# Altium schematic sheet switching_noise_board.SchDoc: Switching Noise Board
size A4; DrawnBy: Rajat Chaple; Revision: 0.0.1; SheetNumber: 1; SheetTotal: 1
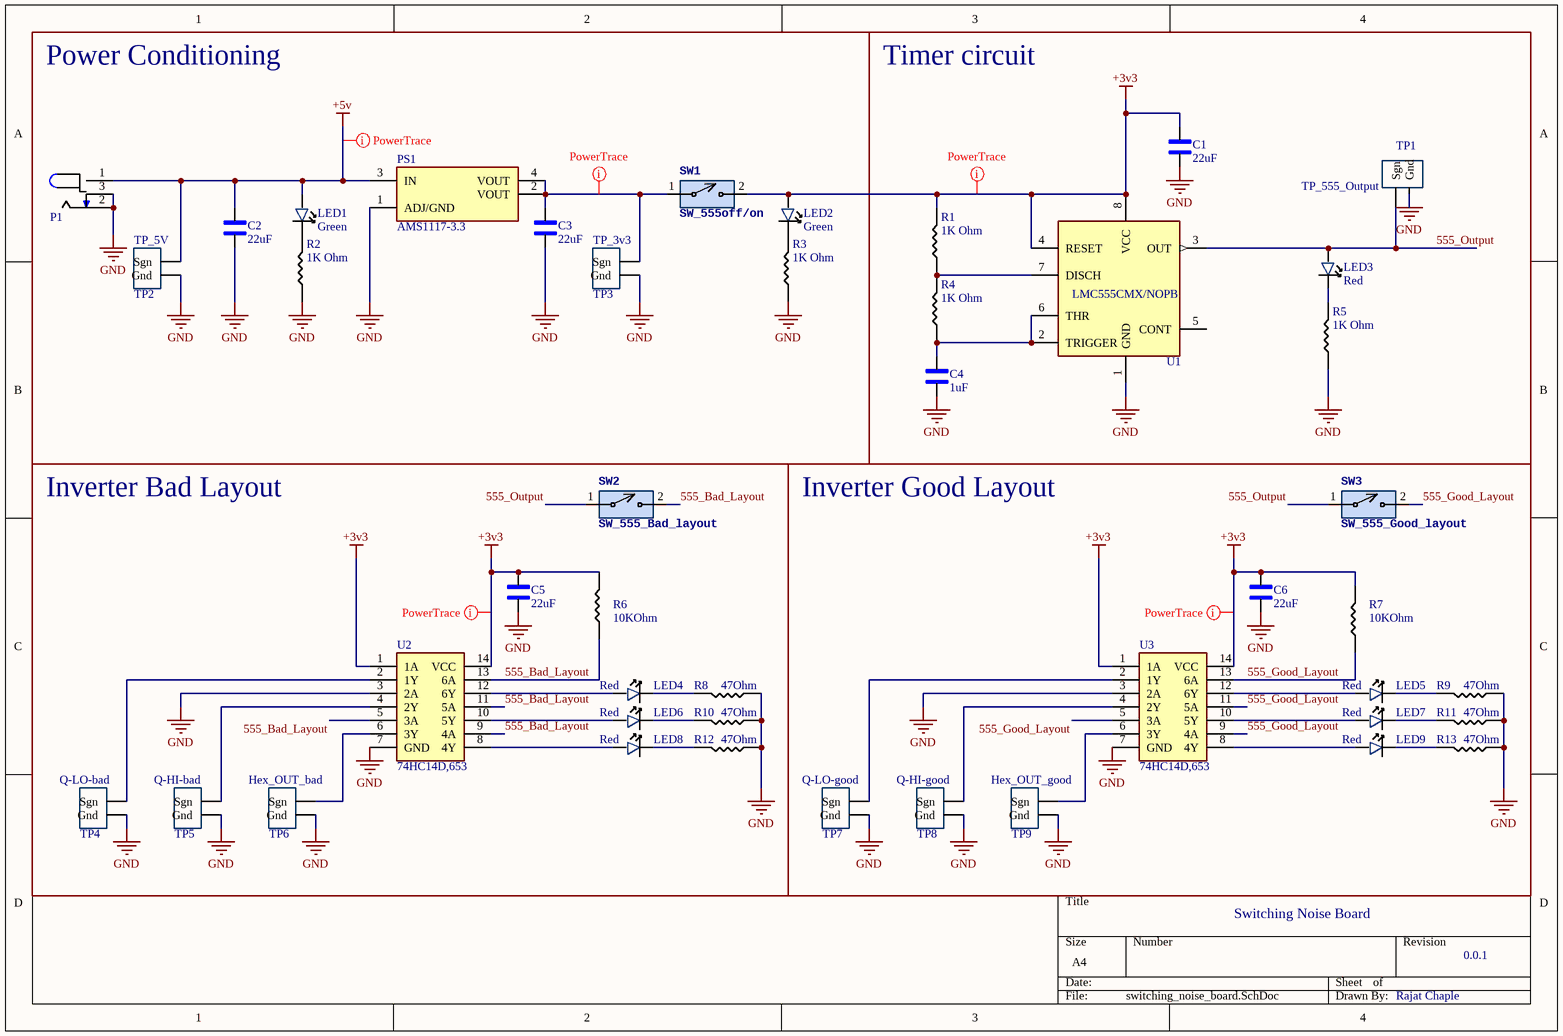
[diagram p0: switching_noise_board.SchDoc]

## Parts
C1  22uF  [0805_Passive_Capaciitor]
C2  22uF  [0805_Passive_Capaciitor]
C3  22uF  [0805_Passive_Capaciitor]
C4  1uF  [0402_Passive_Capacitor]
C5  22uF  [0805_Passive_Capaciitor]
C6  22uF  [0805_Passive_Capaciitor]
LED1  value Green  [LED_0603]  (hidden comment: KT-0603R)
LED2  value Green  [LED_0603]  (hidden comment: KT-0603R)
LED3  value Red  [LED_0603]  (hidden comment: KT-0603R)
LED4  value Red  [LED_0603]  (hidden comment: KT-0603R)
LED5  value Red  [LED_0603]  (hidden comment: KT-0603R)
LED6  value Red  [LED_0603]  (hidden comment: KT-0603R)
LED7  value Red  [LED_0603]  (hidden comment: KT-0603R)
LED8  value Red  [LED_0603]  (hidden comment: KT-0603R)
LED9  value Red  [LED_0603]  (hidden comment: KT-0603R)
P1  Power Jack  [Power_Jack]  (value not drawn)
PS1  AMS1117-3.3  [LDO]
R1  value 1K Ohm  [0805_Passive_Resistor]  (hidden comment: 1k)
R2  value 1K Ohm  [0805_Passive_Resistor]  (hidden comment: 1k)
R3  value 1K Ohm  [0805_Passive_Resistor]  (hidden comment: 1k)
R4  value 1K Ohm  [0805_Passive_Resistor]  (hidden comment: 1k)
R5  value 1K Ohm  [0805_Passive_Resistor]  (hidden comment: 1k)
R6  value 10KOhm  [0402_Passive_Resistor]  (hidden comment: 10k)
R7  value 10KOhm  [0402_Passive_Resistor]  (hidden comment: 10k)
R8  value 47Ohm  [0402_Passive_Resistor]  (hidden comment: 47 Ohms)
R9  value 47Ohm  [0402_Passive_Resistor]  (hidden comment: 47 Ohms)
R10  value 47Ohm  [0402_Passive_Resistor]  (hidden comment: 47 Ohms)
R11  value 47Ohm  [0402_Passive_Resistor]  (hidden comment: 47 Ohms)
R12  value 47Ohm  [0402_Passive_Resistor]  (hidden comment: 47 Ohms)
R13  value 47Ohm  [0402_Passive_Resistor]  (hidden comment: 47 Ohms)
SW1  SW_555off/on  [2Pin-Header-Conn]
SW2  SW_555_Bad_layout  [2Pin-Header-Conn]
SW3  SW_555_Good_layout  [2Pin-Header-Conn]
TP1  TP_555_Output  [TP10x_Probe]
TP2  TP_5V  [TP10x_Probe]
TP3  TP_3v3  [TP10x_Probe]
TP4  Q-LO-bad  [TP10x_Probe]
TP5  Q-HI-bad  [TP10x_Probe]
TP6  Hex_OUT_bad  [TP10x_Probe]
TP7  Q-LO-good  [TP10x_Probe]
TP8  Q-HI-good  [TP10x_Probe]
TP9  Hex_OUT_good  [TP10x_Probe]
U1  LMC555CMX/NOPB  [TS555IDTTR]
U2  74HC14D,653  [HEX_74AC14]
U3  74HC14D,653  [HEX_74AC14]

## Blocks framed on the sheet
Power Conditioning: C2 C3 LED1 LED2 P1 PS1 R2 R3 SW1 TP2 TP3
Timer circuit: C1 C4 LED3 R1 R4 R5 TP1 U1
Inverter Bad Layout: C5 LED4 LED6 LED8 R6 R8 R10 R12 SW2 TP4-TP6 U2
Inverter Good Layout: C6 LED5 LED7 LED9 R7 R9 R11 R13 SW3 TP7-TP9 U3

## Nets
+3v3: C1.2 C5.2 C6.2 LED2.1 R1.2 R6.2 R7.2 SW1.2 U1.4(RESET) U1.8(VCC) U2.1(1A) U2.14(VCC) U3.1(1A) U3.14(VCC)
+5v: C2.2 LED1.1 P1.1 PS1.3(IN) TP2.1(Sgn)
GND: C1.1 C2.1 C3.1 C4.1 C5.1 C6.1 P1.2 P1.3 PS1.1(ADJ/GND) R2.1 R3.1 R5.1 R8.1 R9.1 R10.1 R11.1 R12.1 R13.1 TP1.2(Gnd) TP2.2(Gnd) TP3.2(Gnd) TP4.2(Gnd) TP5.2(Gnd) TP6.2(Gnd) TP7.2(Gnd) TP8.2(Gnd) TP9.2(Gnd) U1.1(GND) U2.3(2A) U2.7(GND) U3.3(2A) U3.7(GND)
555_Bad_Layout: R6.1 SW2.2 U2.5(3A) U2.9(4A) U2.11(5A) U2.13(6A)
555_Good_Layout: R7.1 SW3.2 U3.5(3A) U3.9(4A) U3.11(5A) U3.13(6A)
555_Output: LED3.1 SW2.1 SW3.1 TP1.1(Sgn) U1.3(OUT)
NetC3_2: C3.2 PS1.2(VOUT) PS1.4(VOUT) SW1.1 TP3.1(Sgn)
NetC4_2: C4.2 R4.1 U1.2(TRIGGER) U1.6(THR)
NetLED1_2: LED1.2 R2.2
NetLED2_2: LED2.2 R3.2
NetLED3_2: LED3.2 R5.2
NetLED4_1: LED4.1 U2.12(6Y)
NetLED4_2: LED4.2 R8.2
NetLED5_1: LED5.1 U3.12(6Y)
NetLED5_2: LED5.2 R9.2
NetLED6_1: LED6.1 U2.10(5Y)
NetLED6_2: LED6.2 R10.2
NetLED7_1: LED7.1 U3.10(5Y)
NetLED7_2: LED7.2 R11.2
NetLED8_1: LED8.1 U2.8(4Y)
NetLED8_2: LED8.2 R12.2
NetLED9_1: LED9.1 U3.8(4Y)
NetLED9_2: LED9.2 R13.2
NetR1_1: R1.1 R4.2 U1.7(DISCH)
NetTP4_1: TP4.1(Sgn) U2.2(1Y)
NetTP5_1: TP5.1(Sgn) U2.4(2Y)
NetTP6_1: TP6.1(Sgn) U2.6(3Y)
NetTP7_1: TP7.1(Sgn) U3.2(1Y)
NetTP8_1: TP8.1(Sgn) U3.4(2Y)
NetTP9_1: TP9.1(Sgn) U3.6(3Y)

Not connected (* = marked no-connect by the designer): U1 5(CONT)

## Layout directives
rule Width Constraint [Pref Width = 20mil    Min Width = 10mil    Max Width = 100mil]: +3v3, +5v, NetC3_2

## Library data of the parts
C1-C3 C5 C6 = C_22uF_0805: MULTILAYER CERAMIC CAPACITORS MLCC - SMD/SMT 22UF 25V 0805 ROHS; MFR Part #: CL21A226MAQNNNE; Type: Basic; Datasheet: https://datasheet.lcsc.com/szlcsc/Samsung-Electro-Mechanics-CL21A226MAQNNNE_C45783.pdf; LCSC Part#: C45783; Value: 22uF
C4 = C_1uF_0402: MULTILAYER CERAMIC CAPACITORS MLCC - SMD/SMT 1UF 25V 0402 ROHS; MFR Part #: CL05A105KA5NQNC; Type: Basic; Datasheet: https://datasheet.lcsc.com/szlcsc/Samsung-Electro-Mechanics-CL05A105KA5NQNC_C52923.pdf; LCSC Part#: C52923; Value: 1uF
LED1 LED2 = LED_GREEN_0603: LIGHT EMITTING DIODES (LED) GREEN 520~535NM 112~258MCD@20MA TOP VIEW 0603 ROHS; MFR Part #: 19-217/GHC-YR1S2/3T; Type: Basic; LCSC Part#: C72043
LED3-LED9 = LED_RED_0603: LIGHT EMITTING DIODES (LED) RED 520~625NM 90~100MCD@20MA TOP VIEW 0603 ROHS; Type: Basic; Datasheet: https://datasheet.lcsc.com/szlcsc/Everlight-Elec-19-217-BHC-ZL1M2RY-3T_C72041.pdf; MFR Part #: KT-0603R; LCSC Part#: C2286
P1 = P_Power Jack: Power Barrel Connector Jack 2.10mm ID (0.083"), 5.50mm OD (0.217") Through Hole, Right Angle; Value: CONN PWR JACK 2X5.5MM SOLDER; Digikey Link: https://www.digikey.com/product-detail/en/PJ-102A/CP-102A-ND/275425/?itemSeq=304982367; Digikey Part: CP-102A-ND; LCSC Part#: C136744; Type: Extended
PS1 = PS_AMS_LDO_3v3: LOW DROPOUT REGULATORS(LDO) POSITIVE FIXED 1.3V @ 800MA 15V 3.3V 1A SOT-223 ROHS; Value: IC REG LINEAR 3.3V 800MA SOT223; MFR Part #: AMS1117-3.3; LCSC Part#: C6186; Type: Basic
R1-R5 = R_1K_0805: CHIP RESISTOR - SURFACE MOUNT 1KOHMS ±1% 1/8W 0805 ROHS; MFR Part #: 0805W8F1001T5E; LCSC Part#: C17513; Type: Basic
R6 R7 = R_10KOhm_0402: CHIP RESISTOR - SURFACE MOUNT 10KOHMS ±1% 1/16W 0402 ROHS; MFR Part #: 0402WGF1002TCE; Datasheet: https://datasheet.lcsc.com/szlcsc/Uniroyal-Elec-0402WGF1002TCE_C25744.pdf; LCSC Part#: C25744; Type: Basic
R8-R13 = R_47Ohm_0402: CHIP RESISTOR - SURFACE MOUNT 47OHMS ±1% 1/16W 0402 ROHS; MFR Part #: 0402WGF470JTCE; Datasheet: https://datasheet.lcsc.com/szlcsc/Uniroyal-Elec-0402WGF470JTCE_C25118.pdf; LCSC Part#: C25118; Type: Basic
SW1-SW3 = SW_2Pin_100mil_Switch: 2Pin Header; LCSC Part#: C124375; Type: Extended
TP1-TP9 = TP_10x_Probe: Test Point 300 mil centers
U1 = U_555_Fast: 555 Type, Timer/Oscillator _Single_ IC 3MHz 8-SO; Package: SOIC-8; MFR Part #: LMC555CMX/NOPB; DigiKey-Purchase-URL: https://www.digikey.com/product-detail/en/texas-instruments/LMC555CMX-NOPB/LMC555CMX-NOPBCT-ND/1010550; LCSC Part#: C90760; Type: Extended
U2 U3 = U_7414_HC_Hex: Inverter IC 6 Channel Schmitt Trigger 14-SOIC; Datasheet: https://datasheet.lcsc.com/szlcsc/ON-Semicon-ON-74AC14SCX_C5482.pdf; MFR Part #: 74HC14D,653; LCSC Part#: C5605; Type: Basic